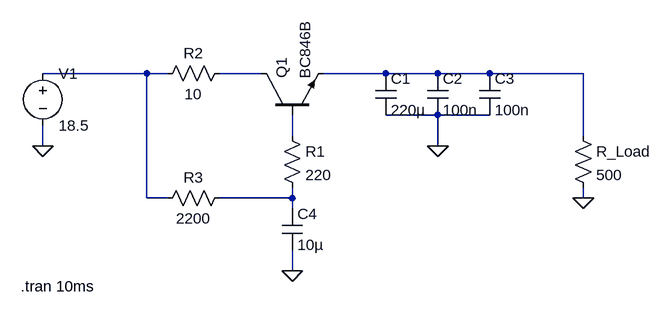
[diagram p0: schematic psu_actidamp.asc]
psu_actidamp.asc, the LTspice schematic file:
Version 4
SHEET 1 880 680
WIRE -48 16 -208 16
WIRE -16 16 -48 16
WIRE 128 16 64 16
WIRE 320 16 224 16
WIRE 400 16 320 16
WIRE 480 16 400 16
WIRE 624 16 480 16
WIRE 400 80 320 80
WIRE 480 80 400 80
WIRE 176 112 176 80
WIRE 624 112 624 16
WIRE -208 128 -208 96
WIRE 400 128 400 80
WIRE -48 208 -48 16
WIRE -16 208 -48 208
WIRE 176 208 176 192
WIRE 176 208 64 208
WIRE 624 208 624 192
WIRE 176 224 176 208
WIRE 176 320 176 288
FLAG 400 128 0
FLAG 176 320 0
FLAG 624 208 0
FLAG -208 128 0
SYMBOL npn 128 80 R270
SYMATTR InstName Q1
SYMATTR Value BC846B
SYMBOL cap 304 16 R0
SYMATTR InstName C1
SYMATTR Value 220µ
SYMBOL cap 384 16 R0
SYMATTR InstName C2
SYMATTR Value 100n
SYMBOL cap 464 16 R0
SYMATTR InstName C3
SYMATTR Value 100n
SYMBOL cap 160 224 R0
SYMATTR InstName C4
SYMATTR Value 10µ
SYMBOL res 160 96 R0
SYMATTR InstName R1
SYMATTR Value 220
SYMBOL res 80 0 R90
WINDOW 0 0 56 VBottom 2
WINDOW 3 32 56 VTop 2
SYMATTR InstName R2
SYMATTR Value 10
SYMBOL res 80 192 R90
WINDOW 0 0 56 VBottom 2
WINDOW 3 32 56 VTop 2
SYMATTR InstName R3
SYMATTR Value 2200
SYMBOL res 608 96 R0
SYMATTR InstName R_Load
SYMATTR Value 500
SYMBOL voltage -208 0 R0
WINDOW 123 0 0 Left 0
WINDOW 39 0 0 Left 0
SYMATTR InstName V1
SYMATTR Value 18.5
TEXT -242 344 Left 2 !.tran 10ms

The netlist it stands for:
* psu_actidamp.asc
Q1 N002 N004 N003 0 BC846B
C1 N003 0 220µ
C2 N003 0 100n
C3 N003 0 100n
C4 N005 0 10µ
R1 N004 N005 220
R2 N002 N001 10
R3 N005 N001 2200
R_Load N003 0 500
V1 N001 0 18.5
.model NPN NPN
.model PNP PNP
.lib standard.bjt
.tran 10ms
.backanno
.end